# Altium schematic sheet EFR32G13_POWER_RESET.SchDoc (part 3 of 3)
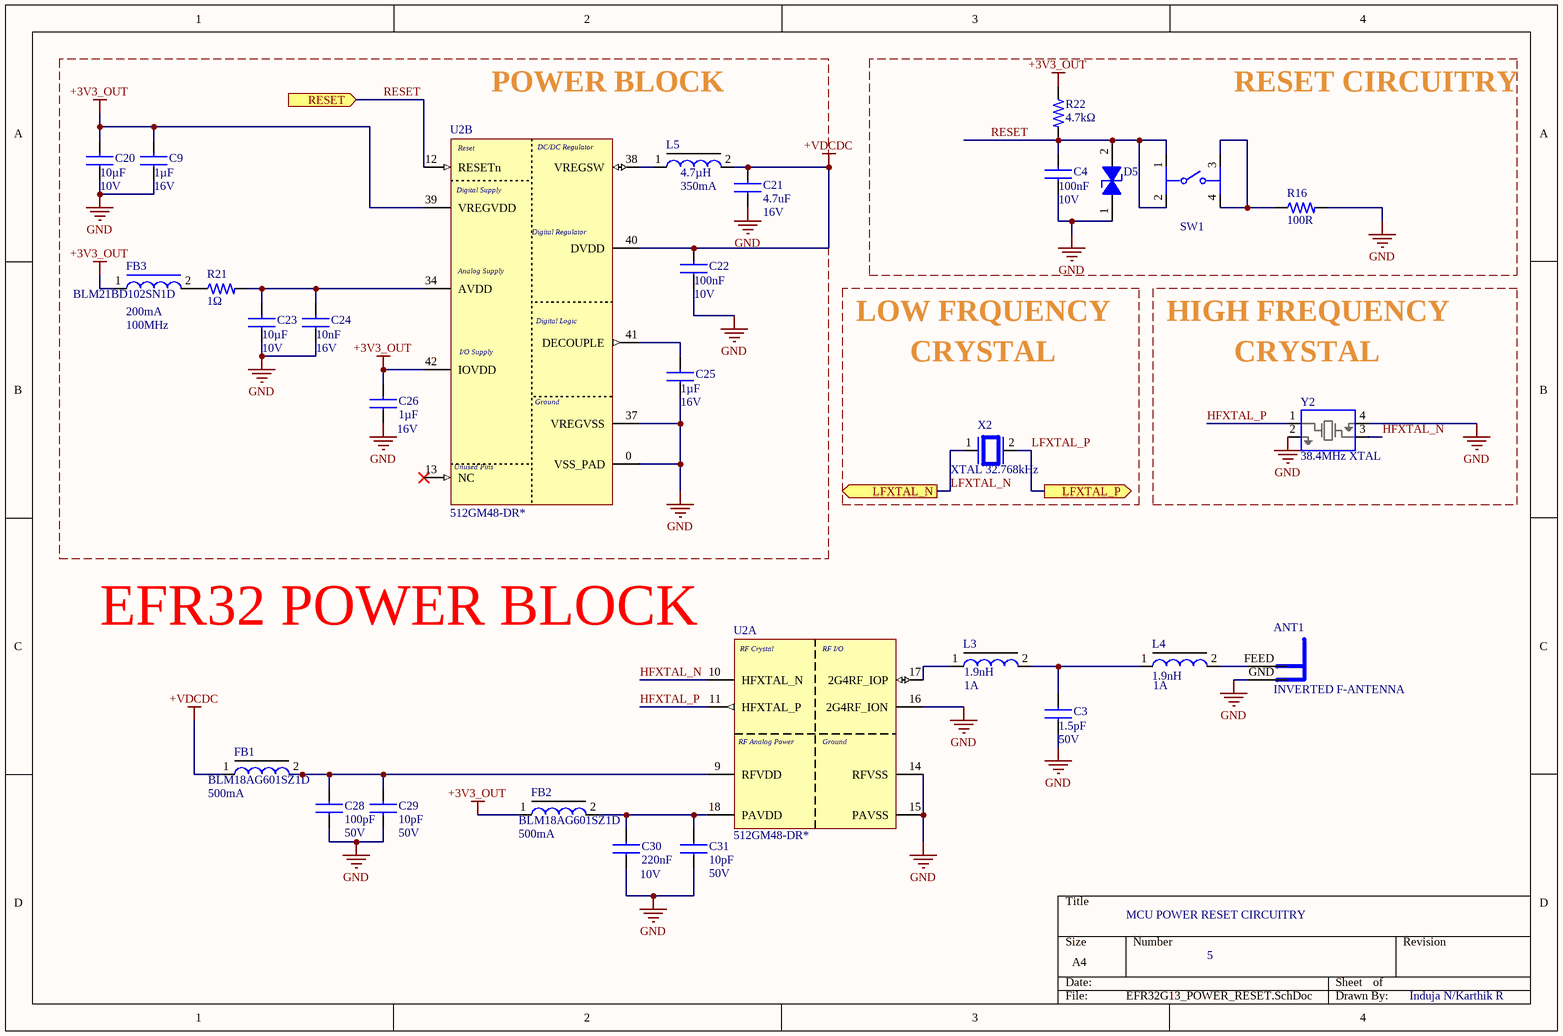
[diagram p2: EFR32G13_POWER_RESET.SchDoc]

## Library data of the parts (continued)
SW1 = PTS526 SK15 SMTR2 LFS: Switch Tactile SPST N.O. 0.05A 12VDC 200000Cycles Gull Wing Surface Mount T/R; Manufacturer: C&K Components; Contact Current Rating: 50mA; Contact Resistance: 100mΩ; Life (Cycles): 200kcycles; Number of Positions: 2; Voltage Rating (DC): 12V; Supplier: DigiKey; Supplier Part Number: CKN12221-1-ND; Manufacturer Part Number: PTS526 SK15 SMTR2 LFS; RoHS: Compliant; Category: Tactile Switches; Stock: 26301; Pricing: 1=0.14, 10=0.127, 25=0.1192, 100=0.1073, 250=0.09968, 500=0.09408, 1000=0.08878 (USD); Height: 1.65mm; Lifecycle Status: Production; Max Operating Temperature: 70°C; Min Operating Temperature: -20°C; REACH SVHC: Yes; Schedule B: 8536509065, 8536509065|8536509065|8536509065|8536509065|8536509065; ComponentLink1URL: https://datasheet.octopart.com:443/PTS526SK15SMTR2LFS-C%26K-Components-datasheet-166147767.pdf?src-supplier=TME; ComponentLink1Description: https://datasheet.octopart.com:443/PTS526SK15SMTR2LFS-C%26K-Components-datasheet-166147767.pdf?src-supplier=TME; ComponentLink2URL: https://datasheet.octopart.com:443/PTS526-SK15-SMTR2-LFS-C%26K-Components-datasheet-168052134.pdf?src-supplier=Newark; ComponentLink2Description: https://datasheet.octopart.com:443/PTS526-SK15-SMTR2-LFS-C%26K-Components-datasheet-168052134.pdf?src-supplier=Newark; ComponentLink3URL: https://datasheet.octopart.com:443/PTS526SK15SMTR2LFS-C%26K-Components-datasheet-154834492.pdf?src-supplier=Electro+Sonic; ComponentLink3Description: https://datasheet.octopart.com:443/PTS526SK15SMTR2LFS-C%26K-Components-datasheet-154834492.pdf?src-supplier=Electro+Sonic; ComponentLink4URL: https://datasheet.octopart.com:443/PTS526SK15SMTR2LFS-C%26K-Components-datasheet-138817219.pdf?src-supplier=Future+Electronics; ComponentLink4Description: https://datasheet.octopart.com:443/PTS526SK15SMTR2LFS-C%26K-Components-datasheet-138817219.pdf?src-supplier=Future+Electronics
U2 = EFR32BG13P732F512GM48-DR: Blue Gecko QFN48 2.4 G 19 dB BLE/Proprietary 512 kB 64 kB(RAM) 31GPIO; Manufacturer: Silicon Labs; Manufacturer Lifecycle Status: FULL PRODUCTION; Flash Memory Size: 512kB; Max Supply Voltage: 3.8V; Min Supply Voltage: 1.8V; Number of Digital IO: 31; Number of I2C Channels: 2; Number of SPI Channels: 3; Number of UART Channels: 8; Number of USART Channels: 4; Operating Supply Voltage: 3.3V; RAM Size: 64kB; Supplier: DigiKey; Supplier Part Number: 336-EFR32BG13P732F512GM48-DRCT-ND; Manufacturer Part Number: EFR32BG13P732F512GM48-DR; RoHS: Compliant; Category: System on Chip (SoC); Stock: 8802; Pricing: 1=7.38, 10=6.396, 25=6.0548, 100=5.586, 250=5.30508, 500=5.10674, 1000=4.91994 (USD); Height - Seated (Max): 900µm; Length: 7mm; Lifecycle Status: Production; Max Operating Temperature: 85°C; Min Operating Temperature: -40°C; Number of GPIO: 31; Number of Terminals: 48; Terminal Pitch: 500µm; Width: 7mm; ComponentLink1URL: https://datasheet.octopart.com:443/EFR32BG13P732F512GM48-DR-Silicon-Labs-datasheet-180782262.pdf?src-supplier=IHS; ComponentLink1Description: https://datasheet.octopart.com:443/EFR32BG13P732F512GM48-DR-Silicon-Labs-datasheet-180782262.pdf?src-supplier=IHS; ComponentLink2URL: https://datasheet.octopart.com:443/EFR32BG13P732F512GM48-DR-Silicon-Labs-datasheet-150822224.pdf?src-supplier=Silicon+Labs; ComponentLink2Description: https://datasheet.octopart.com:443/EFR32BG13P732F512GM48-DR-Silicon-Labs-datasheet-150822224.pdf?src-supplier=Silicon+Labs; ComponentLink3URL: https://datasheet.octopart.com:443/EFR32BG13P732F512GM48-DR-Silicon-Labs-datasheet-142345357.pdf?src-supplier=Silicon+Labs+SCT; ComponentLink3Description: https://datasheet.octopart.com:443/EFR32BG13P732F512GM48-DR-Silicon-Labs-datasheet-142345357.pdf?src-supplier=Silicon+Labs+SCT; ComponentLink4URL: https://datasheet.octopart.com:443/EFR32BG13P732F512GM48-DR-Silicon-Labs-datasheet-150822225.pdf?src-supplier=Farnell; ComponentLink4Description: https://datasheet.octopart.com:443/EFR32BG13P732F512GM48-DR-Silicon-Labs-datasheet-150822225.pdf?src-supplier=Farnell
X2 = XTAL 32.768kHz: Crystal 0.032768MHz ±20ppm (Tol) 12.5pF Flexural 70000Ohm 2-Pin CSMD T/R; Manufacturer: Abracon; Manufacturer Part Number: ABS07-32.768KHZ-H-T; Additional Feature: TAPE AND REEL; Aging: 3 PPM/FIRST YEAR; Crystal/Resonator Type: PARALLEL - FUNDAMENTAL; Drive Level: 0.5uW; ESR: 70kR; Supplier: Mouser; Supplier Part Number: 535-ABS07-32.768KHZ-H-TTR-ND; RoHS: Yes; Category: Crystals; Stock: 349794; Pricing: 1=0.64, 10=0.502, 50=0.502, 100=0.463, 500=0.438, 1000=0.419, 3000=0.308, 6000=0.281, 9000=0.269, 10000=0.269, 24000=0.258 (USD); Mounting Technology: Surface Mount; Min Operating Temperature: -40°C; Max Operating Temperature: 85°C; Frequency Tolerance: 20ppm; Load Capacitance: 12.5pF; Operating Frequency-Nom: 0.032768; Reach SVHC Compliant: Yes; RoHS Compliant: Yes; ComponentLink1URL: https://datasheet.ciiva.com:443/pdfs/VipMasterIC/IC/ABRC/ABRC-S-A0006623177/ABRC-S-A0006623177-1.pdf?src-supplier=IHS+Markit; ComponentLink1Description: https://datasheet.ciiva.com:443/pdfs/VipMasterIC/IC/ABRC/ABRC-S-A0006623177/ABRC-S-A0006623177-1.pdf?src-supplier=IHS+Markit; ComponentLink2URL: https://datasheet.ciiva.com/854/abs07-854935.pdf?src-supplier=Digikey; ComponentLink2Description: https://datasheet.ciiva.com/854/abs07-854935.pdf?src-supplier=Digikey; ComponentLink3URL: https://datasheet.ciiva.com/854/abs07-854936.pdf?src-supplier=Digikey; ComponentLink3Description: https://datasheet.ciiva.com/854/abs07-854936.pdf?src-supplier=Digikey; ComponentLink4URL: https://datasheet.ciiva.com/854/abs07-854937.pdf?src-supplier=Digikey; ComponentLink4Description: https://datasheet.ciiva.com/854/abs07-854937.pdf?src-supplier=Digikey; ComponentLink5URL: https://datasheet.ciiva.com/15214/getdatasheetpartid-727011-15214954.pdf?src-supplier=Verical; ComponentLink5Description: https://datasheet.ciiva.com/15214/getdatasheetpartid-727011-15214954.pdf?src-supplier=Verical; ComponentLink6URL: https://datasheet.ciiva.com/7998/1912628-7998667.pdf?src-supplier=Element14; ComponentLink6Description: https://datasheet.ciiva.com/7998/1912628-7998667.pdf?src-supplier=Element14; Case/Package: CSMD; Pins: 2; Package Quantity: 3000; Tolerance: 20ppm; ESR (Equivalent Series Resistance): 70kR; Frequency: 32.768kHz; Packaging: Tape and Reel; Termination: SMD/SMT; Series: ABS07; Operating Frequency: 32.768 kHz; Length: 3.2mm; Width: 1.5mm; Height: 0.9mm; Depth: 1.5mm; Radiation Hardening: No; Lead Free: Lead Free; ComponentLink7URL: https://datasheet.ciiva.com/1357/1883680-1357319.pdf?src-supplier=Element14; ComponentLink7Description: https://datasheet.ciiva.com/1357/1883680-1357319.pdf?src-supplier=Element14; ComponentLink8URL: https://datasheet.ciiva.com/4944/abs07-11028-4944830.pdf?src-supplier=Mouser; ComponentLink8Description: https://datasheet.ciiva.com/4944/abs07-11028-4944830.pdf?src-supplier=Mouser; Supplier 1: DigiKey; Supplier Part Number 1: 535-ABS07-32.768KHZ-H-TCT-ND
Y2 = 38.4MHz XTAL: Fundamental Active RoHS Compliant MHz Crystal Crystal 10pF 0.022 0.55mm -20C~70C 80Ohm; Manufacturer: TXC; Manufacturer Part Number: 8Y38472012; Supplier: DigiKey; Supplier Part Number: 887-8Y38472012CT-ND; Category: Crystals; Stock: 5079; Pricing: 1=0.78, 10=0.674, 25=0.6372, 50=0.611, 100=0.5857, 250=0.55384, 500=0.53094, 1000=0.50897 (USD); Supplier 1: DigiKey; Supplier Part Number 1: 887-8Y38472012CT-ND